# Altium schematic sheet IMU.SchDoc
size A; SheetNumber: 3; SheetTotal: 4
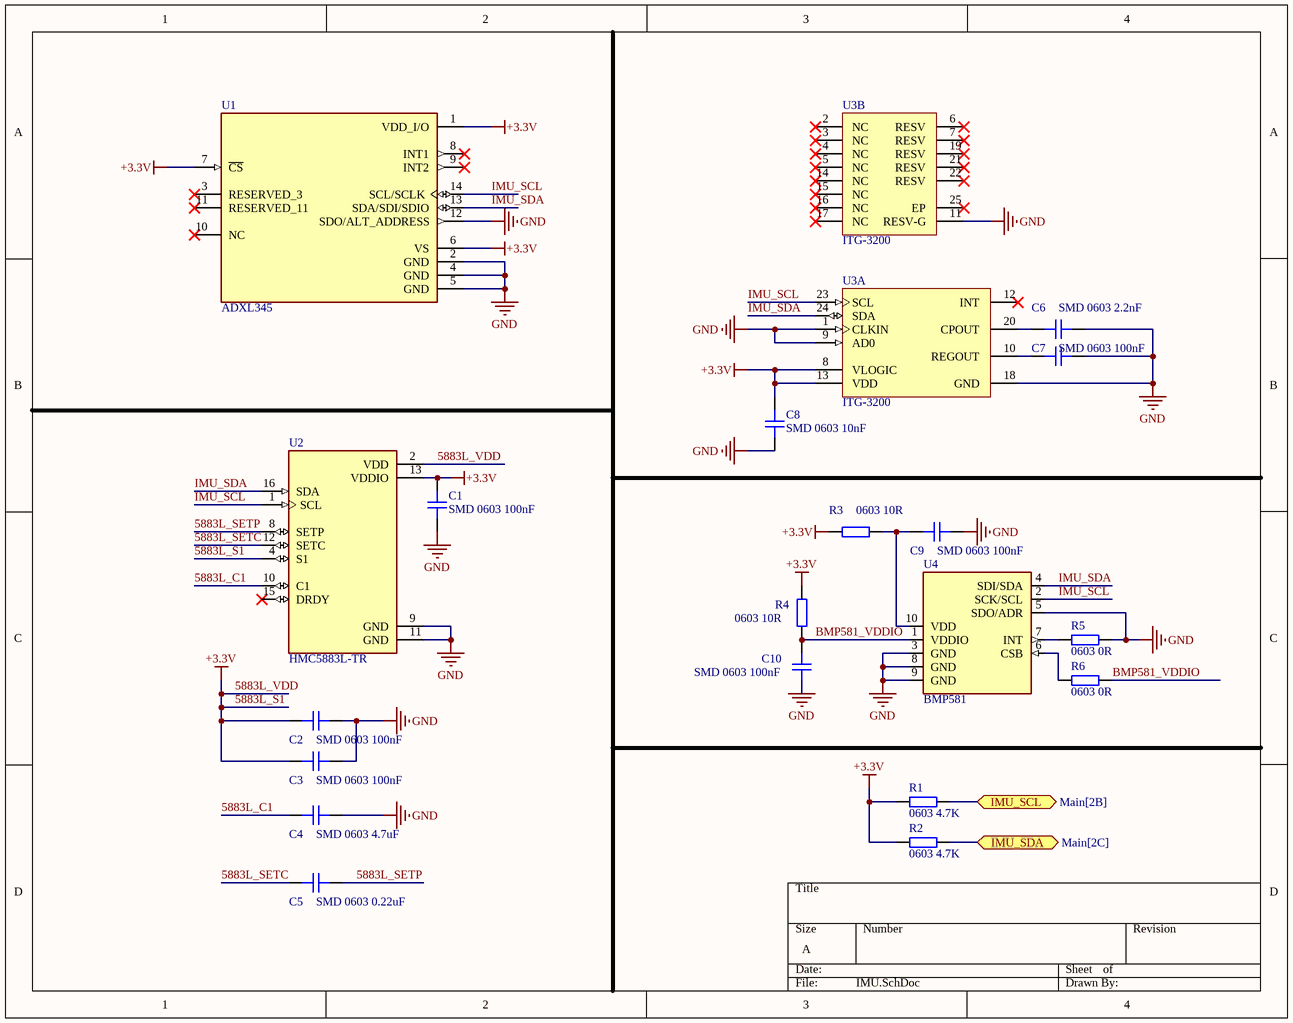
[diagram p0: IMU.SchDoc]

## Parts
C1  SMD 0603 100nF  [CAP_0603]
C2  SMD 0603 100nF  [CAP_0603]
C3  SMD 0603 100nF  [CAP_0603]
C4  SMD 0603 4.7uF  [CAP_0603]
C5  SMD 0603 0.22uF  [CAP_0603]
C6  SMD 0603 2.2nF  [CAP_0603]
C7  SMD 0603 100nF  [CAP_0603]
C8  SMD 0603 10nF  [CAP_0603]
C9  SMD 0603 100nF  [CAP_0603]
C10  SMD 0603 100nF  [CAP_0603]
R1  0603 4.7K  [RES_0603]
R2  0603 4.7K  [RES_0603]
R3  0603 10R  [RES_0603]
R4  0603 10R  [RES_0603]
R5  0603 0R  [RES_0603]
R6  0603 0R  [RES_0603]
U1  ADXL345  [PQFN80P500X300X100-14N]
U2  HMC5883L-TR  [XDCR_HMC5883L-TR]
U3  ITG-3200  [INSE-QFN-24_A_L]  (parts A,B of 2)
U4  BMP581  [BMP581]

## Ports
IMU_SCL (bidir, see Main[2B]), IMU_SDA (bidir, see Main[2C])

## Nets
5883L_S1: C1.2 C2.1 C3.1 C8.1 R1.2 R2.2 R3.1 R4.1 U1.1(VDD_I/O) U1.6(VS) U1.7(~{CS}) U2.2(VDD) U2.4(S1) U2.13(VDDIO) U3.8(VLOGIC) U3.13(VDD)  [also labelled +3.3V, 5883L_VDD]
GND: C1.1 C2.2 C3.2 C4.2 C6.1 C7.2 C8.2 C9.2 C10.2 R5.2 U1.2(GND) U1.4(GND) U1.5(GND) U1.12(SDO/ALT_ADDRESS) U2.9(GND) U2.11(GND) U3.1(CLKIN) U3.9(AD0) U3.11(RESV-G) U3.18(GND) U4.3(GND) U4.5(SDO/ADR) U4.8(GND) U4.9(GND)
5883L_C1: C4.1 U2.10(C1)
5883L_SETC: C5.1 U2.12(SETC)
5883L_SETP: C5.2 U2.8(SETP)
BMP581_VDDIO: C10.1 R4.2 R6.2 U4.1(VDDIO)
IMU_SCL: U1.14(SCL/SCLK) U2.1(SCL) U3.23(SCL) U4.2(SCK/SCL)
IMU_SCL: R1.1 ; port IMU_SCL  [a separate net that carries the same name]
IMU_SDA: U1.13(SDA/SDI/SDIO) U2.16(SDA) U3.24(SDA) U4.4(SDI/SDA)
IMU_SDA: R2.1 ; port IMU_SDA  [a separate net that carries the same name]
NetC6_2: C6.2 U3.20(CPOUT)
NetC7_1: C7.1 U3.10(REGOUT)
NetC9_1: C9.1 R3.2 U4.10(VDD)
NetR5_1: R5.1 U4.7(INT)
NetR6_1: R6.1 U4.6(CSB)

Not connected (* = marked no-connect by the designer): U1 3(RESERVED_3)* 8(INT1)* 9(INT2)* 10(NC)* 11(RESERVED_11)*; U2 15(DRDY)*; U3 2(NC)* 3(NC)* 4(NC)* 5(NC)* 6(RESV)* 7(RESV)* 12(INT)* 14(NC)* 15(NC)* 16(NC)* 17(NC)* 19(RESV)* 21(RESV)* 22(RESV)* 25(EP)*

## Library data of the parts
C1-C10 = CAP_0603: Capacitor SMD 0603; Manufacturer: *; Manufacturer Part Number: *; Distributor Link: *; LCSC: *; Rating: *; Dielectric: *
R1-R6 = RES_0603: Resistor SMD 0603; Manufacturer: *; Manufacturer Part Number: *; Distributor Link: *; LCSC: *
U1 = ADXL345: Accelerometer X, Y, Z Axis ±2g, 4g, 8g, 16g 0.05Hz ~ 1.6kHz 14-LGA (3x5); MF: Analog Devices, Inc.; SnapEDA_Link: https://www.snapeda.com/parts/ADXL345/Analog+Devices/view-part/?ref=snap; Package: LGA -14 Analog Devices; Value: *; MP: ADXL345; Check_prices: https://www.snapeda.com/parts/ADXL345/Analog+Devices/view-part/?ref=eda
U2 = HMC5883L-TR: Board Mount Hall Effect / Magnetic Sensors Sensors, Transducers Magnetic - Hall Effect, Digital Switch, Linear, Compass (ICs) - IC COMPASS 3 AXIS I2C 16LCC SMD; MF: STMicroelectronics; MP: HMC5883LTR; SnapEDA_Link: https://www.snapeda.com/parts/HMC5883LTR/STMicroelectronics/view-part/?ref=snap; Package: LCC-16 STMicroelectronics; Value: *; Check_prices: https://www.snapeda.com/parts/HMC5883LTR/STMicroelectronics/view-part/?ref=eda
U3 = CMP-1753-00001-1: Single-Chip, Digital-Output, MEMS Gyroscope, 2.1 to 3.6 V, -40 to 105 degC, 24 -Pin QFN, RoHS, Tape and Reel; ComponentLink2URL: http://www.farnell.com/datasheets/887152.pdf; Lead Pitch: 0.1 inch; ComponentLink1Description: Manufacturer URL; Package Quantity: 1; PackageReference: QFN-24_A; ComponentLink1URL: http://www.invensense.com/; Contact Finish: Tin; Packaging: Bulk; RoHSCompliant: True; Mount: Through Hole; ComponentLink2Description: Datasheet; PackageDescription: 24-Pin Quad Flat No-lead Package, Body 4.00 x 4.00 mm, Pitch 0.50 mm, Thermal Pad 3.00 x 2.80 mm; DatasheetVersion: Rev. 1.4, 03/2010; Pins: 36; Colour: Black
U4 = BMP581: Very small, low-power and low noise 24-bit absolute barometric pressure sensor. This digital, high-performance sensor is ideally suited for a wide range of altitude tracking applications and offers outstanding design flexibility; MF: Bosch; Package: None; Price: None; Value: *; SnapEDA_Link: https://www.snapeda.com/parts/BMP581/Bosch/view-part/?ref=snap; MP: BMP581; Availability: Unavailable; Check_prices: https://www.snapeda.com/parts/BMP581/Bosch/view-part/?ref=eda